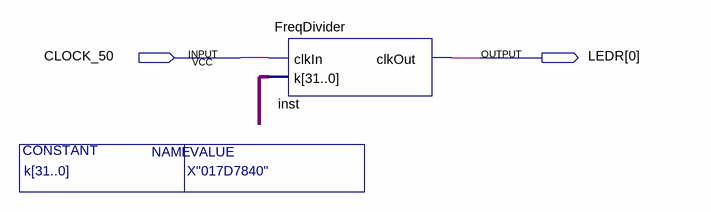
[diagram p0: schematic sheet]
// Quartus schematic FreqDivider_Demo.bdf as structural Verilog: 1 symbols, 2 pins
module FreqDivider_Demo #(parameter \k[31..0]  = "X\"017D7840\"") (
  input  CLOCK_50,
  output [0:0] LEDR
);

  wire [31:0] undriven;

  FreqDivider inst (.clkIn(CLOCK_50), .k(undriven), .clkOut(LEDR[0]));
endmodule
